# EAGLE design ymf262-board (EAGLE 5.02)
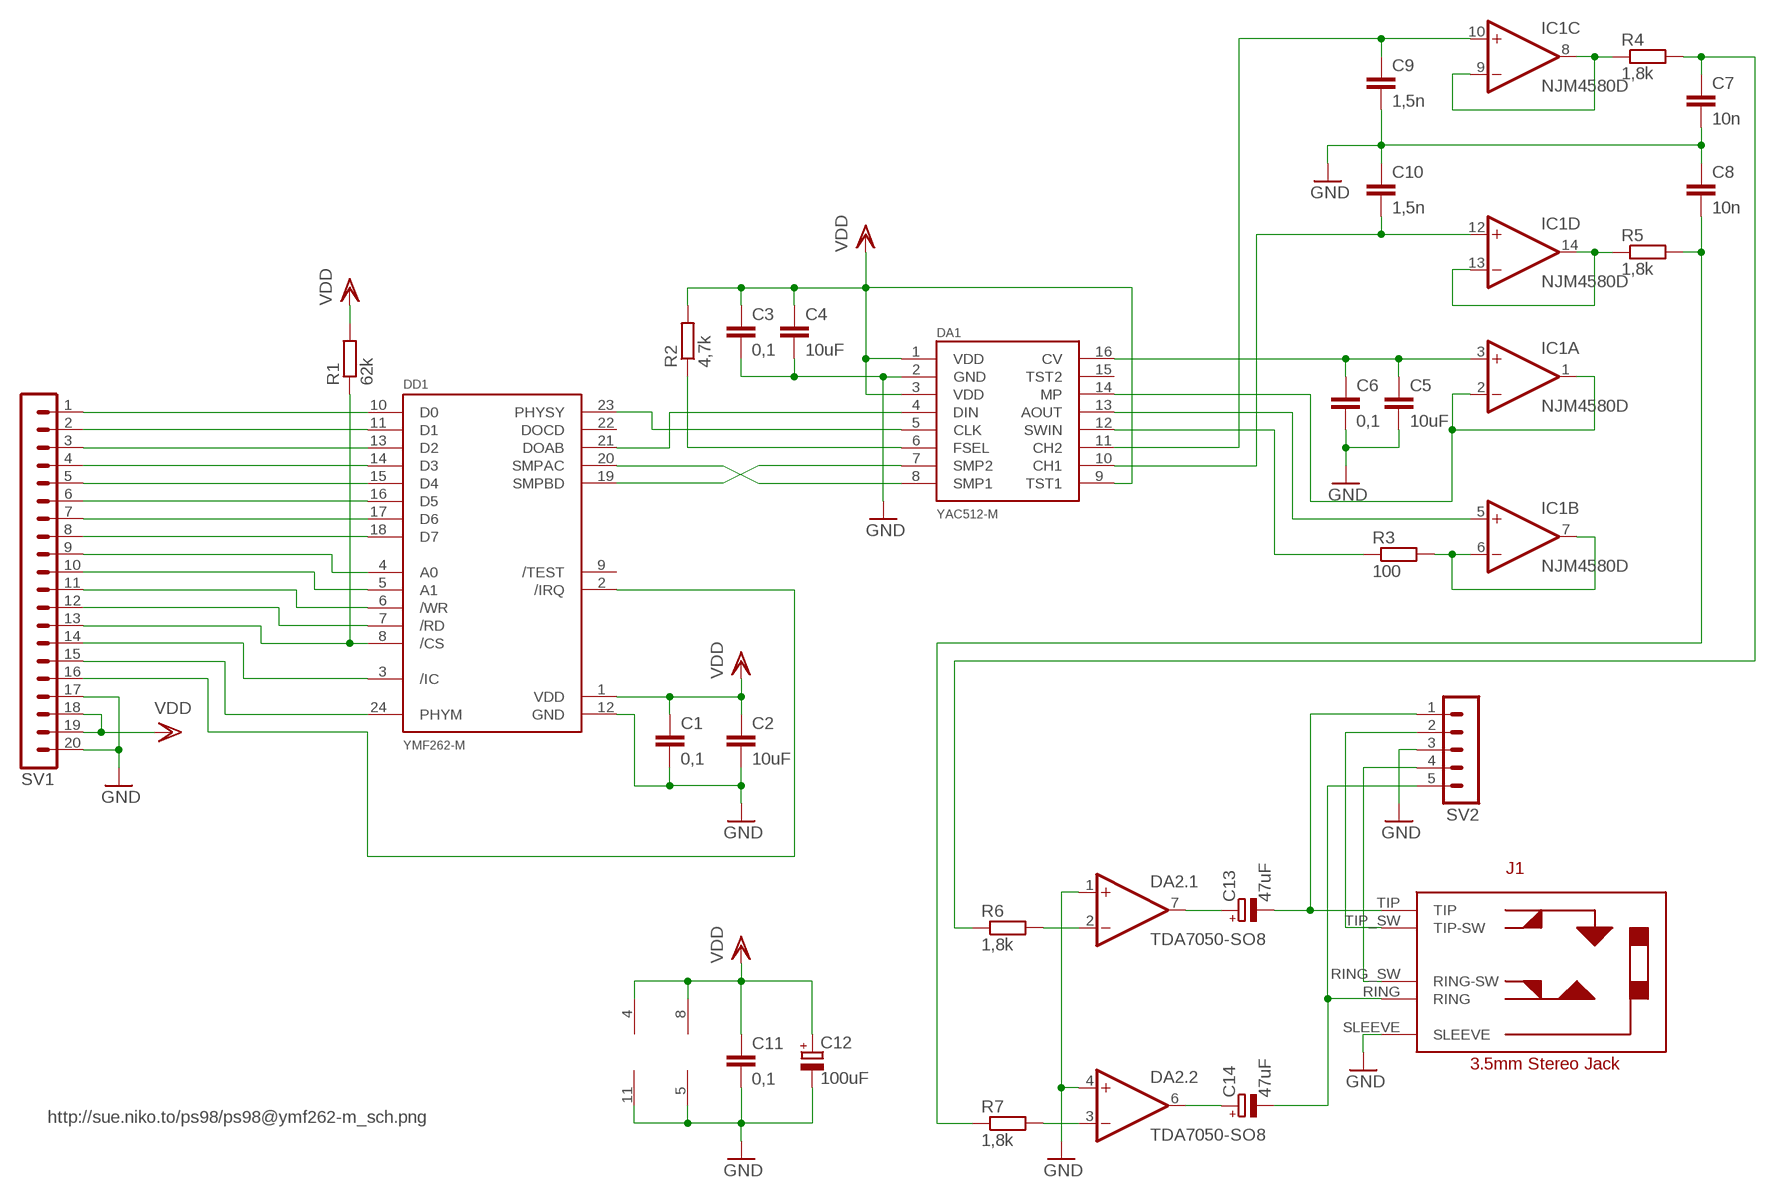
[diagram p0: schematic, sheet 1]

## Parts
C1  0,1  C-C0805K  [C0805K]
C2  10uF  C-C0805K  [C0805K]
C3  0,1  C-C0805K  [C0805K]
C4  10uF  C-C0805K  [C0805K]
C5  10uF  C-C0805K  [C0805K]
C6  0,1  C-C0805K  [C0805K]
C7  10n  C-C0805K  [C0805K]
C8  10n  C-C0805K  [C0805K]
C9  1,5n  C-C0805K  [C0805K]
C10  1,5n  C-C0805K  [C0805K]
C11  0,1  C-C0805K  [C0805K]
C12  100uF  CPOL-SMCD  [SMC_D]
C13  47uF  CPOL-SMCD  [SMC_D]
C14  47uF  CPOL-SMCD  [SMC_D]
DA1  YAC512-M  [SOIC16N]
DA2  TDA7050-SO8  [SO08]
DD1  YMF262-M  [SO24R]
IC1  NJM4580D  4AMP_P4+11D  [SO14]
J1  PICAXE_STEREOJACKSOCKET  [PICAXE_STEREOJACKSOCKET]
R1  62k  R-R0805  [R0805]
R2  4,7k  R-R0805  [R0805]
R3  100  R-R0805  [R0805]
R4  1,8k  R-R0805  [R0805]
R5  1,8k  R-R0805  [R0805]
R6  1,8k  R-R0805  [R0805]
R7  1,8k  R-R0805  [R0805]
SV1  MA20-1  [MA20-1]
SV2  MA05-1  [MA05-1]

## Nets
GND: C1.2 C2.2 C3.2 C4.2 C5.2 C6.2 C7.2 C8.1 C9.2 C10.1 C11.2 C12.- DA1.2(GND) DA2.1(.1:+IN) DA2.4(.2:+IN) DA2.5(P:V-) DD1.12(GND) IC1.11(P:V-) J1.SLEEVE SV1.17 SV1.20 SV2.3
N$1: DA1.6(FSEL) R2.1
N$2: C5.1 C6.1 DA1.16(CV) IC1.3(A:+IN)
N$3: DD1.8(/CS) R1.1 SV1.13
N$4: DD1.10(D0) SV1.1
N$5: DD1.11(D1) SV1.2
N$6: DD1.13(D2) SV1.3
N$7: DD1.14(D3) SV1.4
N$8: DD1.15(D4) SV1.5
N$9: DD1.16(D5) SV1.6
N$10: DD1.17(D6) SV1.7
N$11: DD1.7(/RD) SV1.12
N$12: DD1.3(/IC) SV1.14
N$13: DD1.6(/WR) SV1.11
N$14: DD1.24(PHYM) SV1.15
N$15: DD1.18(D7) SV1.8
N$16: DD1.4(A0) SV1.9
N$17: DD1.5(A1) SV1.10
N$18: DA1.4(DIN) DD1.21(DOAB)
N$19: DA1.5(CLK) DD1.23(PHYSY)
N$20: DA1.8(SMP1) DD1.20(SMPAC)
N$21: DA1.14(MP) IC1.1(A:OUT) IC1.2(A:-IN)
N$22: DA1.7(SMP2) DD1.19(SMPBD)
N$23: IC1.13(D:-IN) IC1.14(D:OUT) R5.1
N$24: C8.2 R5.2 R7.1
N$25: DA1.13(AOUT) IC1.5(B:+IN)
N$26: IC1.6(B:-IN) IC1.7(B:OUT) R3.2
N$27: C14.- J1.RING SV2.5
N$28: DA1.12(SWIN) R3.1
N$29: C10.2 DA1.10(CH1) IC1.12(D:+IN)
N$30: C9.1 DA1.11(CH2) IC1.10(C:+IN)
N$31: IC1.8(C:OUT) IC1.9(C:-IN) R4.1
N$32: C7.1 R4.2 R6.1
N$33: C13.+ DA2.7(.1:OUT)
N$34: C14.+ DA2.6(.2:OUT)
N$35: DA2.2(.1:-IN) R6.2
N$36: DA2.3(.2:-IN) R7.2
N$37: C13.- J1.TIP SV2.1
N$38: DD1.2(/IRQ) SV1.16
N$39: J1.TIP_SW(TIP-SW) SV2.2
N$40: J1.RING_SW(RING-SW) SV2.4
VDD: C1.1 C2.1 C3.1 C4.1 C11.1 C12.+ DA1.1(VDD) DA1.3(VDD) DA1.9(TST1) DA2.8(P:V+) DD1.1(VDD) IC1.4(P:V+) R1.2 R2.2 SV1.18 SV1.19
Unconnected: DA1.15(TST2) DD1.9(/TEST) DD1.22(DOCD)

## Notes on the sheet
- http://sue.niko.to/ps98/ps98@ymf262-m_sch.png

## Library data of the parts
C1-C11 = discrete:C-: CAPACITOR, European symbol
C12-C14 = discrete:CPOL-: POLARIZED CAPACITOR, European symbol
DA1 = ymf262:YAC512: Analog interface for YMF262
DA2 = ymf262:TDA7050
DD1 = ymf262:YMF262: FM Operator Type L3 (OPL3)
IC1 = ymf262:4AMP_P4+11: OP AMP
J1 = connectors:PICAXE_STEREOJACKSOCKET
R1-R7 = discrete:R-: RESISTOR, European symbol
SV1 = connectors:MA20-1: PIN HEADER
SV2 = connectors:MA05-1: PIN HEADER

## Board
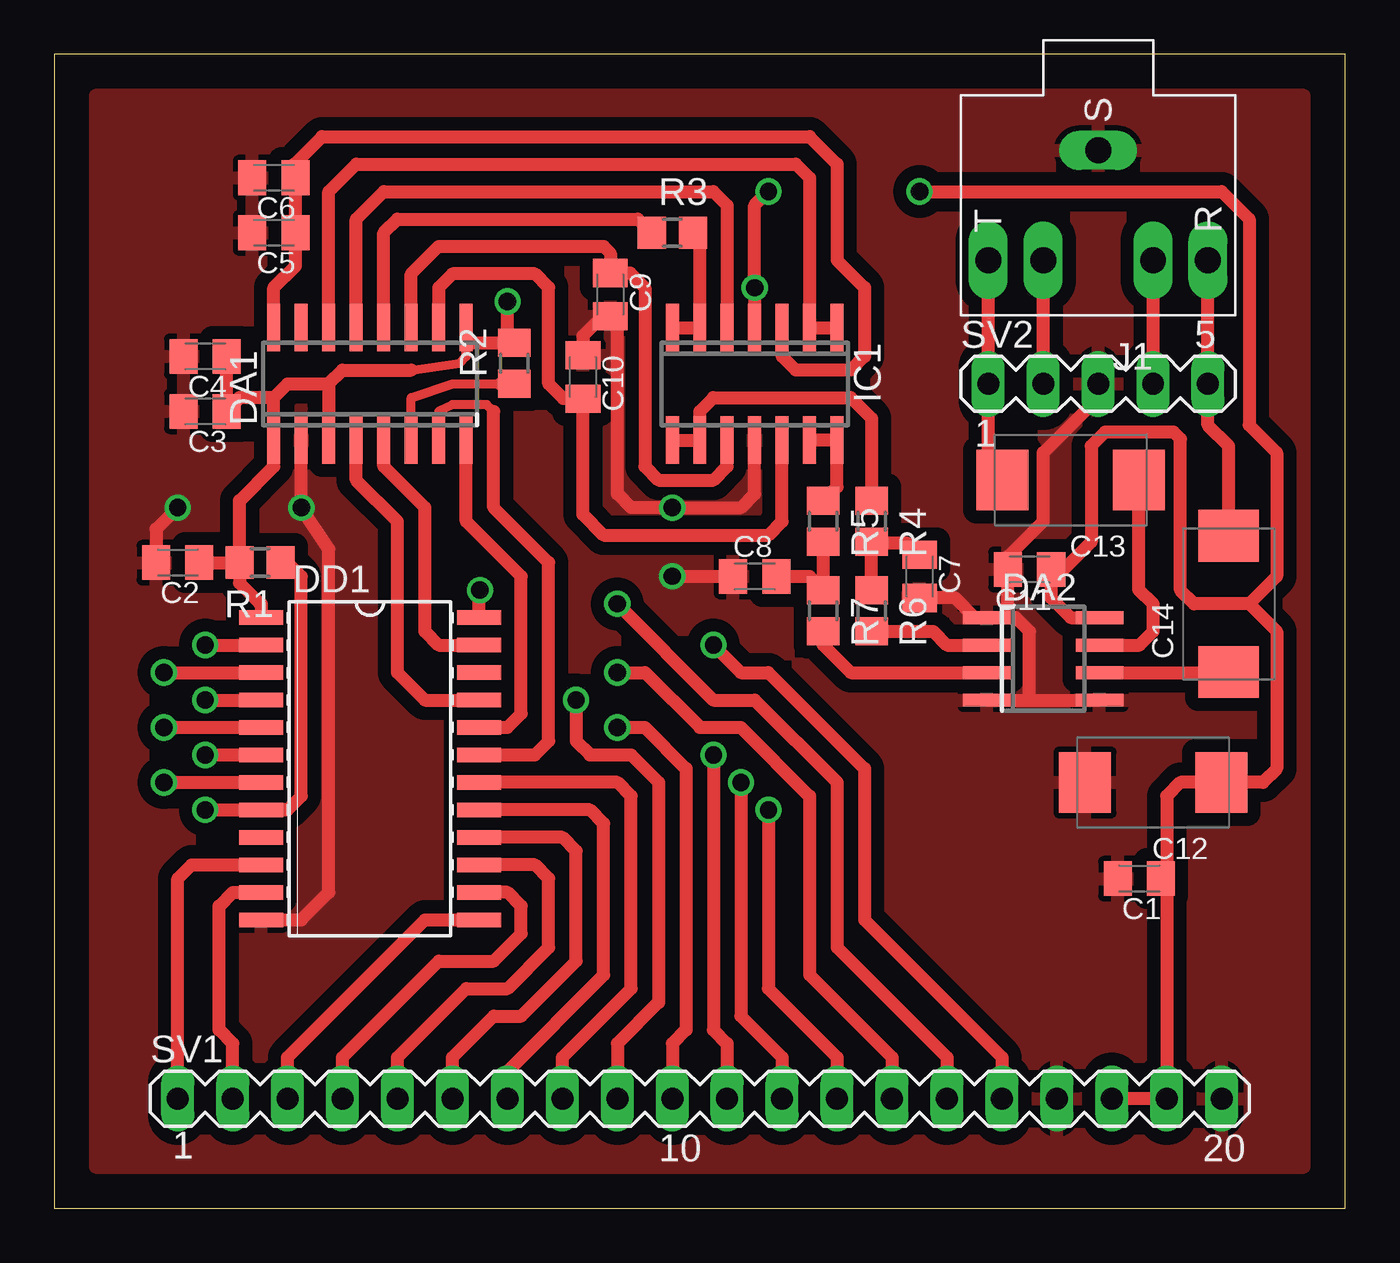
[diagram p1: board, top side]
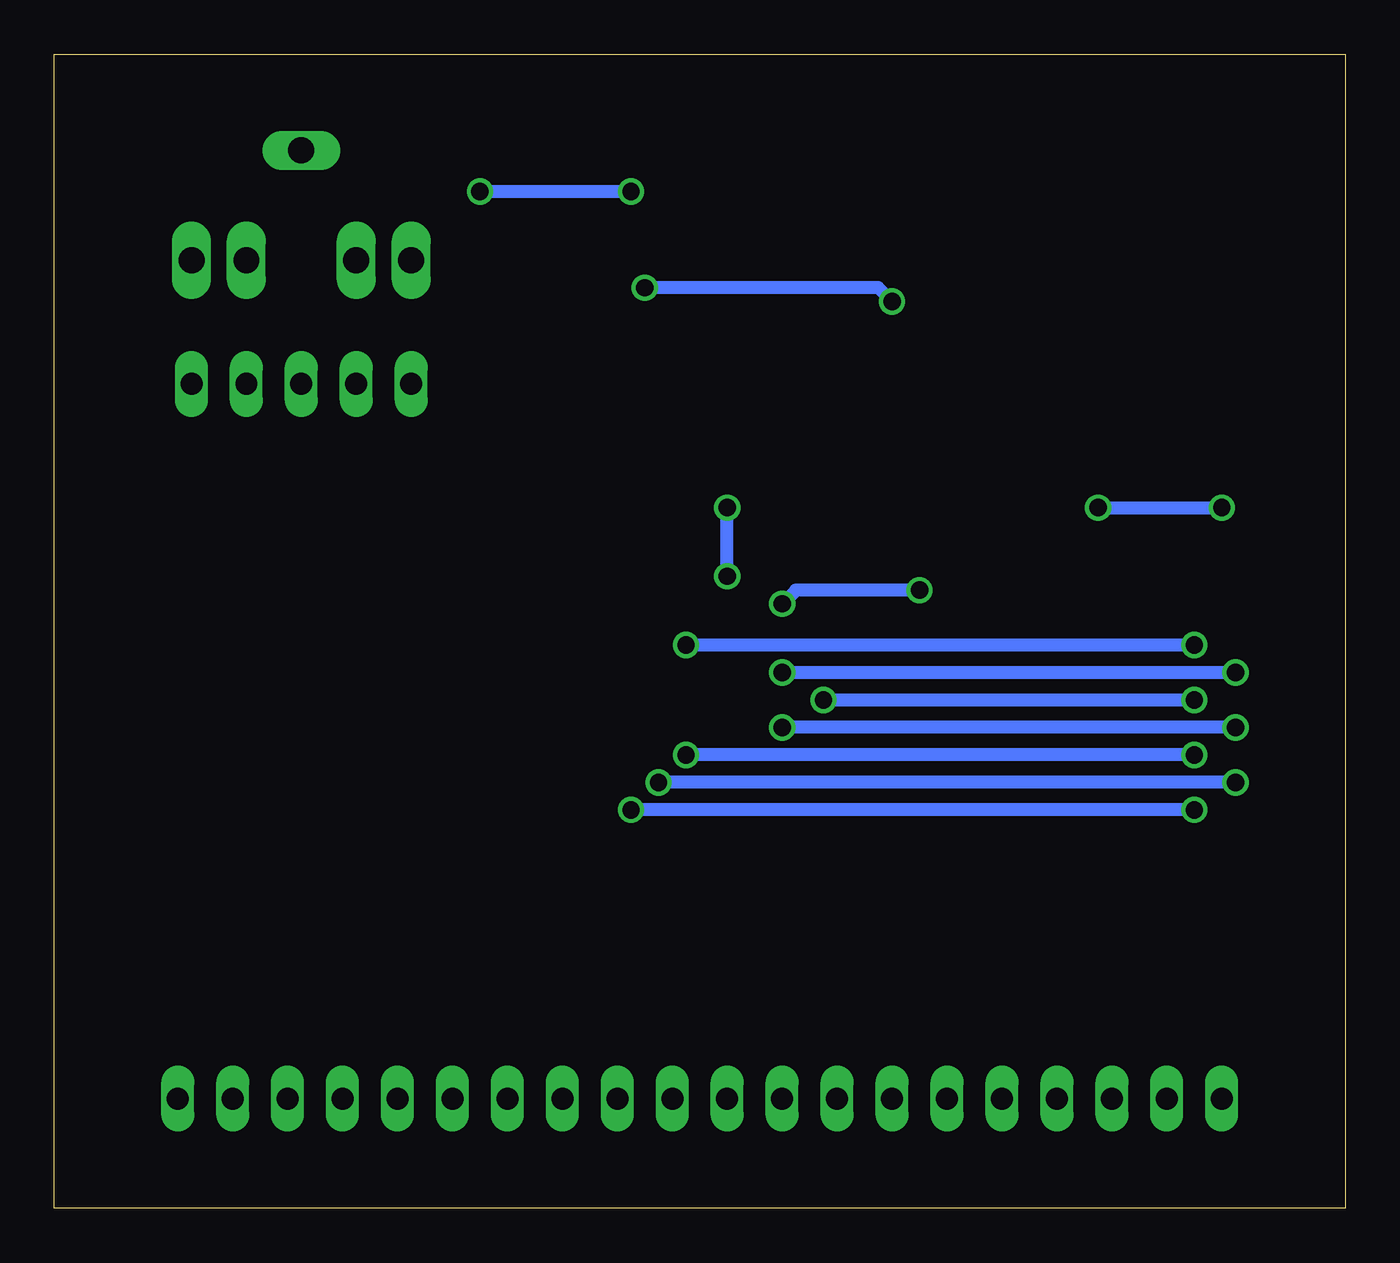
[diagram p2: board, bottom side, seen from below]

Size 59.69 x 53.34 mm. Coordinates in mm from the lower left corner, seen from the top.
Outline: 59.69,0 59.69,53.34 0,53.34 0,0 59.69,0
Copper layers (1*16): Top 0.035mm / dielectric 1.5mm / Bottom 0.035mm
Design rules "default": minimum track width 10mil, minimum drill 24mil, track to track 8mil, track to pad 8mil, pad to pad 8mil, via to via 8mil, smd to smd 8mil, copper to edge 40mil, drill to drill 8mil, minimum pad ring 10mil, minimum via ring 8mil, stop-mask expansion 4mil, vias tented up to drill 0mil, thermal gap 10mil

### Footprints (pad centres in the part's own frame; a part is rotated, then mirrored left to right if it is on the bottom)
C0805K = smd 1.3 x 1.6: 1 -1,0; 2 1,0
SMC_D = smd 2.4 x 2.8: + -3.15,0; - 3.15,0
SOIC16N = smd 0.6 x 2.2: 1 -4.445,-2.6; 2 -3.175,-2.6; 3 -1.905,-2.6; 4 -0.635,-2.6; 5 0.635,-2.6; 6 1.905,-2.6; 7 3.175,-2.6; 8 4.445,-2.6; 9 4.445,2.6; 10 3.175,2.6; 11 1.905,2.6; 12 0.635,2.6; 13 -0.635,2.6; 14 -1.905,2.6; 15 -3.175,2.6; 16 -4.445,2.6
SO08 = smd 0.6 x 2.2: 1 -1.905,-2.6; 2 -0.635,-2.6; 3 0.635,-2.6; 4 1.905,-2.6; 5 1.905,2.6; 6 0.635,2.6; 7 -0.635,2.6; 8 -1.905,2.6
SO24R = smd 0.66 x 2.032: 1 -6.985,-5.029; 2 -5.715,-5.029; 3 -4.445,-5.029; 4 -3.175,-5.029; 5 -1.905,-5.029; 6 -0.635,-5.029; 7 0.635,-5.029; 8 1.905,-5.029; 9 3.175,-5.029; 10 4.445,-5.029; 11 5.715,-5.029; 12 6.985,-5.029; 13 6.985,5.029; 14 5.715,5.029; 15 4.445,5.029; 16 3.175,5.029; 17 1.905,5.029; 18 0.635,5.029; 19 -0.635,5.029; 20 -1.905,5.029; 21 -3.175,5.029; 22 -4.445,5.029; 23 -5.715,5.029; 24 -6.985,5.029
SO14 = smd 0.6 x 2.2: 1 -3.81,-2.6; 2 -2.54,-2.6; 3 -1.27,-2.6; 4 0,-2.6; 5 1.27,-2.6; 6 2.54,-2.6; 7 3.81,-2.6; 8 3.81,2.6; 9 2.54,2.6; 10 1.27,2.6; 11 0,2.6; 12 -1.27,2.6; 13 -2.54,2.6; 14 -3.81,2.6
PICAXE_STEREOJACKSOCKET = drill 1.2 long: RING -5.08,-5.08; RING_SW -5.08,-2.54; SLEEVE 0,0; TIP -5.08,5.08; TIP_SW -5.08,2.54
R0805 = smd 1.3 x 1.5: 1 -0.95,0; 2 0.95,0
MA20-1 = drill 1.016 long: 1 -24.13,0; 2 -21.59,0; 3 -19.05,0; 4 -16.51,0; 5 -13.97,0; 6 -11.43,0; 7 -8.89,0; 8 -6.35,0; 9 -3.81,0; 10 -1.27,0; 11 1.27,0; 12 3.81,0; 13 6.35,0; 14 8.89,0; 15 11.43,0; 16 13.97,0; 17 16.51,0; 18 19.05,0; 19 21.59,0; 20 24.13,0
MA05-1 = drill 1.016 long: 1 -5.08,0; 2 -2.54,0; 3 0,0; 4 2.54,0; 5 5.08,0

### Placement (x,y rotation side)
C1  50.16,15.24 180 top
C2  5.71,29.84 180 top
C3  6.99,36.83 180 top
C4  6.99,39.37 180 top
C5  10.16,45.09 180 top
C6  10.16,47.62 180 top
C7  40.01,29.21 270 top
C8  32.38,29.21 0 top
C9  25.72,42.23 270 top
C10  24.45,38.42 270 top
C11  45.09,29.53 180 top
C12  50.8,19.68 180 top
C13  46.99,33.66 180 top
C14  54.29,27.94 90 top
DA1  14.61,38.1 0 top
DA2  45.72,25.4 270 top
DD1  14.61,20.32 270 top
IC1  32.38,38.1 180 top
J1  48.26,48.9 90 top
R1  9.53,29.84 180 top
R2  21.27,39.05 90 top
R3  28.57,45.09 0 top
R4  37.78,31.75 270 top
R5  35.56,31.75 270 top
R6  37.78,27.62 270 top
R7  35.56,27.62 270 top
SV1  29.84,5.08 0 top
SV2  48.26,38.1 0 top

### Tracks (layer width: path | path; a pad name or v marks a point on that pad's centre or on a via)
GND  (via drill 0.8)
  Top 0.61: 45.09,23.5 DA2.5 | DA2.4 45.09,23.5 | DD1.12 11.43,13.34 12.7,14.61 12.7,30.48 v11.43,32.38 DA1.2 | IC1.11 32.38,33.02 31.75,32.38 v28.57,32.38 26.67,32.38 26.04,33.02 26.04,40.64 25.72,40.96 C9.2 25.45,41.23 25.4,41.27 24.45,40.32 C10.1 | 43.81,27.3 44.45,27.3 45.09,26.67 45.09,23.5 | 43.81,27.3 DA2.1 42.55,27.3 41.64,28.21 C7.2 | SV2.3 48.26,37.47 45.72,34.92 45.72,31.75 44.09,30.11 C11.2 44.09,27.57 43.81,27.3 | 31.43,29.21 C8.1 v28.57,29.21 | C2.2 4.71,31.39 v5.71,32.38
  Bottom 0.61: v11.43,32.38 v5.71,32.38 | v28.57,29.21 v28.57,32.38
  pour Top (isolate 0.61): 1.91,51.44 1.91,1.91 57.78,1.91 57.78,51.44
N$1
  Top 0.406: DA1.6 16.51,37.47 18.41,38.1 20.64,38.1
  Top 0.61: R2.1 20.64,38.1
N$2
  Top 0.61: IC1.3 33.66,39.37 34.29,38.73 36.83,38.73 37.47,39.37 37.47,42.55 36.2,43.81 36.2,48.26 34.92,49.53 12.38,49.53 11.11,48.26 | DA1.16 10.16,42.55 11.16,43.55 C5.1 11.16,48.21 11.11,48.26 | 11.11,48.26 C6.1
N$3  (via drill 0.8)
  Top 0.61: 10.79,18.41 DD1.8 | R1.1 10.79,29.84 11.43,29.21 11.43,19.05 10.79,18.41 | v6.99,18.41 10.79,18.41 | v33.02,18.41 33.02,10.16 36.2,6.99 SV1.13
  Bottom 0.61: v6.99,18.41 v33.02,18.41
N$4
  Top 0.61: DD1.10 6.35,15.88 5.71,15.24 SV1.1
N$5
  Top 0.61: DD1.11 8.26,14.61 7.62,13.97 7.62,8.26 8.26,7.62 SV1.2
N$6
  Top 0.61: DD1.13 17.14,13.34 10.79,6.99 SV1.3
N$7
  Top 0.61: DD1.14 20.95,14.61 21.59,13.97 21.59,12.7 20.32,11.43 17.78,11.43 13.34,6.99 SV1.4
N$8
  Top 0.61: DD1.15 22.23,15.88 22.86,15.24 22.86,12.06 20.95,10.16 19.05,10.16 15.88,6.99 SV1.5
N$9
  Top 0.61: DD1.16 23.5,17.14 24.13,16.51 24.13,11.43 21.59,8.89 20.32,8.89 18.41,6.99 SV1.6
N$10
  Top 0.61: DD1.17 24.77,18.41 25.4,17.78 25.4,10.79 20.95,6.35 SV1.7
N$11  (via drill 0.8)
  Top 0.61: v5.08,19.68 DD1.7 | v31.75,19.68 31.75,8.89 33.66,6.99 SV1.12
  Bottom 0.61: v5.08,19.68 v31.75,19.68
N$12  (via drill 0.8)
  Top 0.61: v5.08,24.77 DD1.3 | v26.04,24.77 27.3,24.77 29.84,22.23 31.75,22.23 34.92,19.05 34.92,10.79 38.73,6.99 SV1.14
  Bottom 0.61: v5.08,24.77 v26.04,24.77
N$13  (via drill 0.8)
  Top 0.61: v6.99,20.95 DD1.6 | SV1.11 31.11,7.62 30.48,8.26 v30.48,20.95
  Bottom 0.61: v6.99,20.95 v30.48,20.95
N$14  (via drill 0.8)
  Top 0.61: v26.04,27.94 30.48,23.5 32.38,23.5 36.2,19.68 36.2,12.06 41.27,6.99 SV1.15 | DD1.24 19.63,28.52 v19.68,28.57
  Bottom 0.61: v26.04,27.94 25.4,28.57 v19.68,28.57
N$15
  Top 0.61: DD1.18 26.04,19.68 26.67,19.05 26.67,10.16 23.5,6.99 SV1.8
N$16  (via drill 0.8)
  Top 0.61: v6.99,23.5 DD1.4 | SV1.9 26.04,7.62 27.94,9.53 27.94,19.68 26.67,20.95 24.77,20.95 24.13,21.59 v24.13,23.5
  Bottom 0.61: v6.99,23.5 v24.13,23.5
N$17  (via drill 0.8)
  Top 0.61: v5.08,22.23 DD1.5 | SV1.10 28.57,7.62 29.21,8.26 29.21,20.32 27.3,22.23 v26.04,22.23
  Bottom 0.61: v5.08,22.23 v26.04,22.23
N$18
  Top 0.61: DD1.21 17.14,23.5 15.88,24.77 15.88,31.75 13.97,33.66 DA1.4
N$19
  Top 0.61: DD1.23 17.78,26.04 17.14,26.67 17.14,32.38 15.24,34.29 DA1.5
N$20
  Top 0.61: DD1.20 20.95,22.23 21.59,22.86 21.59,29.21 19.05,31.75 DA1.8
N$21
  Top 0.61: DA1.14 12.7,46.99 13.97,48.26 34.29,48.26 34.92,47.62 IC1.2 34.92,40.64 34.98,40.7 IC1.1
N$22
  Top 0.406: DA1.7 17.78,36.83 18.41,37.15 20,37.15 20.32,36.83
  Top 0.61: DD1.19 22.23,20.95 22.86,21.59 22.86,29.84 20.32,32.38 20.32,36.83
N$23
  Top 0.61: IC1.13 36.13,35.5 36.2,35.56 IC1.14 36.2,33.34 R5.1 | R5.1 35.56,33.02 | R5.1
N$24
  Top 0.61: R7.1 R5.2 | R7.1 | C8.2 34.92,29.21 R7.1
N$25
  Top 0.61: IC1.5 31.11,46.35 30.48,46.99 15.24,46.99 13.97,45.72 DA1.13
N$26
  Top 0.61: R3.2 29.84,44.77 IC1.6 29.84,40.64 29.79,40.7 IC1.7
N$27
  Top 0.61: J1.RING SV2.5 53.34,36.2 54.29,35.24 C14.-
N$28
  Top 0.61: DA1.12 15.24,45.09 15.88,45.72 26.99,45.72 R3.1
N$29
  Top 0.61: DA1.10 17.78,42.55 18.41,43.18 22.23,43.18 22.86,42.55 22.86,38.1 23.54,37.42 C10.2 24.45,32.07 25.4,31.11 33.02,31.11 33.66,31.75 IC1.12
N$30
  Top 0.61: DA1.11 16.51,43.18 17.78,44.45 25.4,44.45 25.72,44.13 C9.1 26.62,43.23 27.3,42.55 27.3,34.29 27.94,33.66 30.48,33.66 31.11,34.29 IC1.10
N$31
  Top 0.61: IC1.8 28.57,35.56 28.64,35.5 IC1.9 29.84,36.83 30.48,37.47 36.83,37.47 37.78,36.51 R4.1
N$32
  Top 0.61: R6.1 R4.2 | R4.2 | R4.2 37.83,30.75 39.42,30.75 40.01,30.16 C7.1
N$33
  Top 0.61: DA2.7 50.16,26.04 50.8,26.67 50.8,27.94 50.14,28.6 C13.+
N$34
  Top 0.61: C14.+ 53.34,24.77 DA2.6
N$35
  Top 0.61: DA2.2 41.27,26.04 40.64,26.67 R6.2
N$36
  Top 0.61: DA2.3 36.83,24.77 35.56,26.04 R7.2
N$37
  Top 0.61: SV2.1 J1.TIP | SV2.1 43.2,38.08 | C13.- 43.84,34.27 43.18,34.92 SV2.1
N$38  (via drill 0.8)
  Top 0.61: v6.99,26.04 DD1.2 | v30.48,26.04 31.75,24.77 33.02,24.77 37.47,20.32 37.47,13.34 43.81,6.99 SV1.16
  Bottom 0.61: v6.99,26.04 v30.48,26.04
N$39
  Top 0.61: SV2.2 J1.TIP_SW
N$40
  Top 0.61: SV2.4 J1.RING_SW
VDD  (via drill 0.8)
  Top 0.406: DA1.9 19.05,40.01 19.05,39.37 18.73,39.05 16.51,38.73
  Top 0.61: 16.51,38.73 13.34,38.73 12.7,38.1 | 12.7,38.1 DA1.3 | 10.16,37.47 10.79,38.1 12.7,38.1 | DD1.1 9.58,27.94 9.53,27.94 8.57,28.89 R1.2 | 10.16,37.47 DA1.1 10.16,34.29 8.57,32.7 R1.2 | 19.05,40.01 20.95,40.01 | IC1.4 v32.38,42.55 32.38,46.35 v33.02,46.99 | 20.95,40.01 v20.95,41.91 | R2.2 20.96,40 20.95,40.01 | 55.24,27.94 52.7,27.94 52.07,28.57 52.07,35.56 51.75,35.88 48.58,35.88 47.94,35.24 47.94,30.8 46.67,29.53 C11.1 46.09,28.21 46.99,27.3 DA2.8 | 55.24,27.94 56.52,26.67 56.52,20.32 55.88,19.68 53.98,19.68 | 53.98,19.68 54.34,19.32 | 55.24,27.94 56.52,29.21 56.52,34.92 55.24,36.2 55.24,45.72 53.98,46.99 v40.01,46.99 | 53.98,19.68 C12.+ | 53.98,19.68 52.07,19.68 51.44,19.05 51.44,15.56 51.12,15.24 | SV1.18 SV1.19 51.44,14.92 51.12,15.24 | C4.1 7.99,36.88 7.94,36.83 | 7.94,36.83 C3.1 | 10.16,37.47 8.57,37.47 7.94,36.83 | C2.1 R1.2 | 51.12,15.24 C1.1
  Bottom 0.61: v32.38,42.55 21.59,42.55 v20.95,41.91 | v33.02,46.99 v40.01,46.99